# EAGLE design ais v1.1 (EAGLE 5.11)
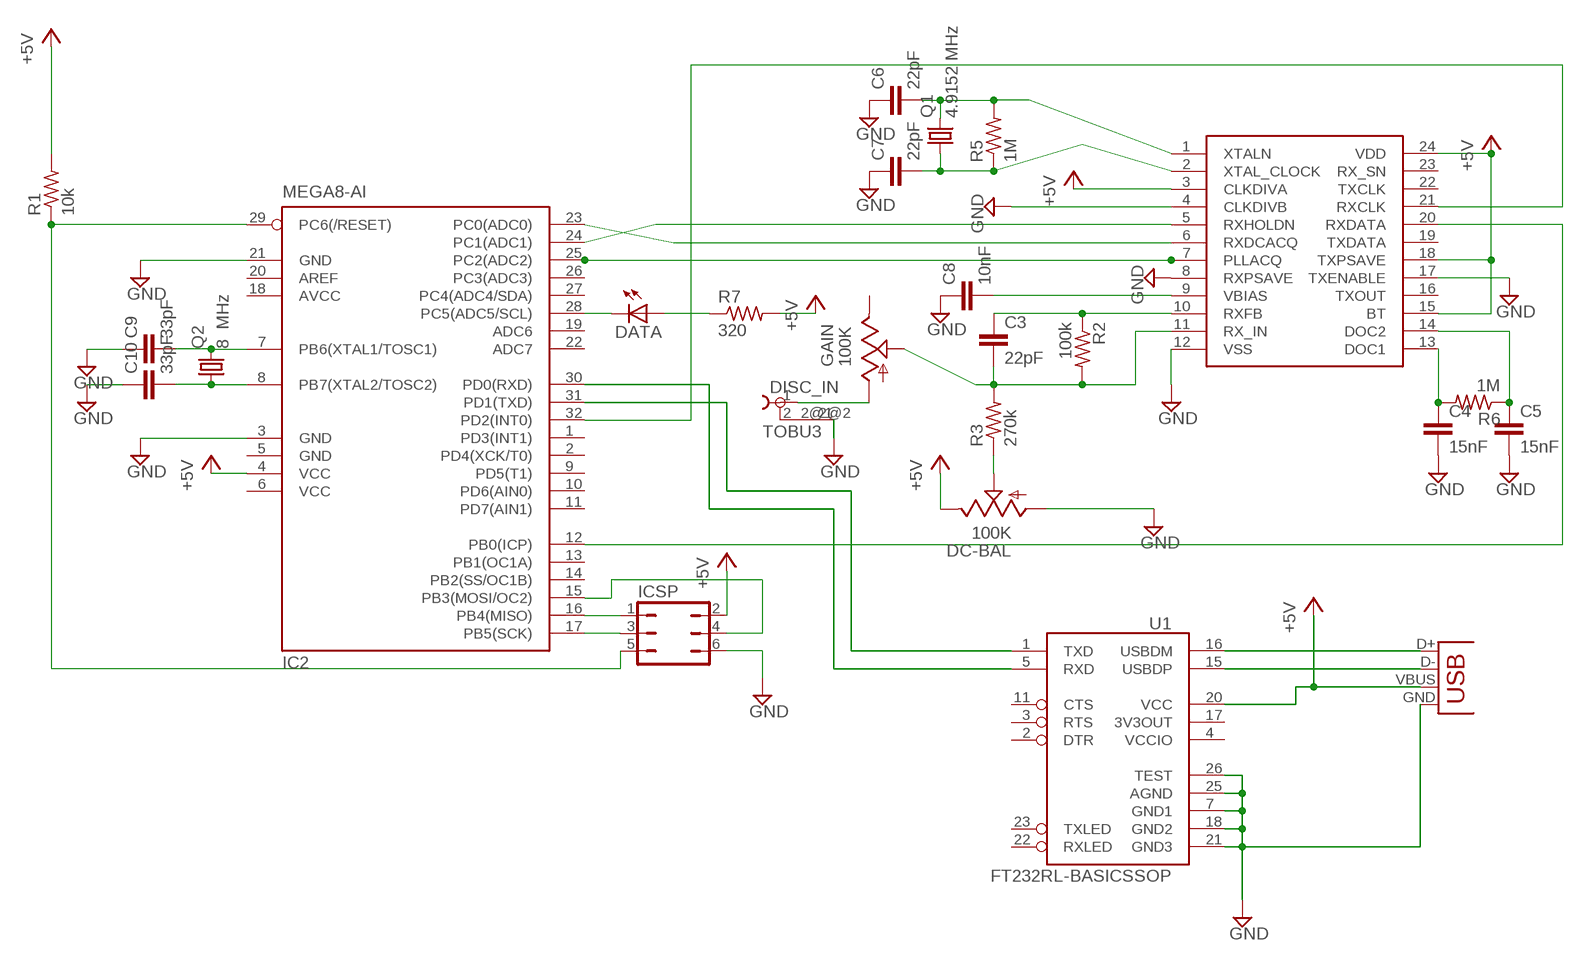
[diagram p0: schematic, sheet 1]

## Parts
C3  22pF  C-EUC0805K  [C0805K]
C4  15nF  C-EUC0805K  [C0805K]
C5  15nF  C-EUC0805K  [C0805K]
C6  22pF  C-EUC0805K  [C0805K]
C7  22pF  C-EUC0805K  [C0805K]
C8  10nF  C-EUC0805K  [C0805K]
C9  33pF  C-EUC0805K  [C0805K]
C10  33pF  C-EUC0805K  [C0805K]
CMX589  CMX589AD2  [DIL24-6]
DATA  LED5MM  [LED5MM]
DC-BAL  100K  TRIM_US-CA6V  [CA6V]
DISC_IN  TOBU3  [TOBU3]
GAIN  100K  TRIM_US-CA6V  [CA6V]
IC2  MEGA8-AI  [TQFP32-08]
ICSP  JP3Q  [JP3Q]
Q1  4.9152 MHz  CRYSTALHC49S  [HC49/S]
Q2  8 MHz  CRYSTALHC49S  [HC49/S]
R1  10k  R-US_0204/7  [0204/7]
R2  100k  R-US_M0805  [M0805]
R3  270k  R-US_M0805  [M0805]
R5  1M  R-US_M0805  [M0805]
R6  1M  R-US_M0805  [M0805]
R7  320  R-US_0309/12  [0309/12]
U1  FT232RL-BASICSSOP  [SSOP28DB]
X1  USBPTH  [USB-B-PTH]

## Nets
+5V: CMX589.3(CLKDIVA) CMX589.15(BT) CMX589.18(TXPSAVE) CMX589.24(VDD) DC-BAL.E IC2.4(VCC) ICSP.2 R1.2 R7.2 U1.20(VCC) X1.VBUS
GND: C4.2 C5.2 C6.1 C7.1 C8.1 C9.1 C10.1 CMX589.4(CLKDIVB) CMX589.8(RXPSAVE) CMX589.12(VSS) CMX589.17(TXENABLE) DISC_IN.2@2 IC2.3(GND) IC2.21(GND) U1.7(GND1) U1.18(GND2) U1.21(GND3) U1.25(AGND) U1.26(TEST) X1.GND
N$1: U1.15(USBDP) X1.D-
N$2: U1.16(USBDM) X1.D+
N$3: IC2.16(PB4(MISO)) ICSP.1
N$4: IC2.17(PB5(SCK)) ICSP.3
N$5: IC2.29(PC6(/RESET)) ICSP.5 R1.1
N$7: C9.2 IC2.7(PB6(XTAL1/TOSC1)) Q2.2
N$8: C10.2 IC2.8(PB7(XTAL2/TOSC2)) Q2.1
N$9: IC2.31(PD1(TXD)) U1.1(TXD)
N$10: C7.2 CMX589.2(XTAL_CLOCK) Q1.1 R5.1
N$11: CMX589.21(RXCLK) IC2.32(PD2(INT0))
N$12: CMX589.5(RXHOLDN) IC2.24(PC1(ADC1))
N$13: CMX589.6(RXDCACQ) IC2.23(PC0(ADC0))
N$14: CMX589.7(PLLACQ) IC2.25(PC2(ADC2))
N$15: CMX589.20(RXDATA) IC2.12(PB0(ICP))
N$16: DISC_IN.1 GAIN.A
N$17: C3.1 CMX589.10(RXFB) R2.1
N$18: DC-BAL.S R3.1
N$19: IC2.30(PD0(RXD)) U1.5(RXD)
N$24: C3.2 CMX589.11(RX_IN) GAIN.S R2.2 R3.2
N$25: C5.1 CMX589.14(DOC2) R6.1
N$26: C4.1 CMX589.13(DOC1) R6.2
N$27: C8.2 CMX589.9(VBIAS)
N$28: DATA.K(C) IC2.28(PC5(ADC5/SCL))
N$29: DATA.A R7.1
N$30: C6.2 CMX589.1(XTALN) Q1.2 R5.2
N$31: IC2.15(PB3(MOSI/OC2)) ICSP.4
N$33: ICSP.6
Unconnected: CMX589.16(TXOUT) CMX589.19(TXDATA) CMX589.22(TXCLK) CMX589.23(RX_SN) DC-BAL.A DISC_IN.2 DISC_IN.2@1 GAIN.E IC2.1(PD3(INT1)) IC2.2(PD4(XCK/T0)) IC2.9(PD5(T1)) IC2.10(PD6(AIN0)) IC2.11(PD7(AIN1)) IC2.13(PB1(OC1A)) IC2.14(PB2(SS/OC1B)) IC2.19(ADC6) IC2.20(AREF) IC2.22(ADC7) IC2.26(PC3(ADC3)) IC2.27(PC4(ADC4/SDA)) U1.2(DTR) U1.3(RTS) U1.11(CTS) U1.17(3V3OUT) U1.22(RXLED) U1.23(TXLED)

## Power pins joined to a net without a drawn wire
AVCC: IC2.18(AVCC)
GND: IC2.5(GND)
VCC: IC2.6(VCC)
VCCIO: U1.4(VCCIO)

## Library data of the parts
C3-C10 = rcl:C-EU: CAPACITOR, European symbol
CMX589 = cmx589:CMX589AD2: GMSK Modem
DATA = led:LED: LED OSRAM: - CHIPLED LG R971, LG N971, LY N971, LG Q971, LY Q971, LO R971, LY R971 LH N974, LH R974 LS Q976, LO Q976, LY Q976 LO Q996 - Hyper CHIPLED LW Q18S LB Q993, LB Q99A, LB R99A - SideLED LS A670, LO A670, LY A670, LG A670, LP A670 LB A673, LV A673, LT A673, LW A673 LH A674 LY A675 LS A676, LA A676, LO A676, LY A676, LW A676 LS A679, LY A679, LG A679 - Hyper Micro SIDELED® LS Y876, LA Y876, LO Y876, LY Y876 LT Y87S - SmartLED LW L88C, LW L88S LB L89C, LB L89S, LG L890 LS L89K, LO L89K, LY L89K LS L896, LA L896, LO L896, LY L896 - TOPLED LS T670, LO T670, LY T670, LG T670, LP T670 LSG T670, LSP T670, LSY T670, LOP T670, LYG T670 LG T671, LOG T671, LSG T671 LB T673, LV T673, LT T673, LW T673 LH T674 LS T676, LA T676, LO T676, LY T676, LB T676, LH T676, LSB T676, LW T676 LB T67C, LV T67C, LT T67C, LS T67K, LO T67K, LY T67K, LW E67C LS E67B, LA E67B, LO E67B, LY E67B, LB E67C, LV E67C, LT E67C LW T67C LS T679, LY T679, LG T679 LS T770, LO T770, LY T770, LG T770, LP T770 LB T773, LV T773, LT T773, LW T773 LH T774 LS E675, LA E675, LY E675, LS T675 LS T776, LA T776, LO T776, LY T776, LB T776 LHGB T686 LT T68C, LB T68C - Hyper Mini TOPLED® LB M676 - Mini TOPLED Santana® LG M470 LS M47K, LO M47K, LY M47K Source: http://www.osram.convergy.de LUXEON: - LUMILED® LXK2-PW12-R00, LXK2-PW12-S00, LXK2-PW14-U00, LXK2-PW14-V00 LXK2-PM12-R00, LXK2-PM12-S00, LXK2-PM14-U00 LXK2-PE12-Q00, LXK2-PE12-R00, LXK2-PE12-S00, LXK2-PE14-T00, LXK2-PE14-U00 LXK2-PB12-K00, LXK2-PB12-L00, LXK2-PB12-M00, LXK2-PB14-N00, LXK2-PB14-P00, LXK2-PB14-Q00 LXK2-PR12-L00, LXK2-PR12-M00, LXK2-PR14-Q00, LXK2-PR14-R00 LXK2-PD12-Q00, LXK2-PD12-R00, LXK2-PD12-S00 LXK2-PH12-R00, LXK2-PH12-S00 LXK2-PL12-P00, LXK2-PL12-Q00, LXK2-PL12-R00 Source: www.luxeon.com KINGBRIGHT: KA-3528ASYC Source: www.kingbright.com
DC-BAL GAIN = pot:TRIM_US-: POTENTIOMETER
DISC_IN = con-hirschmann:TOBU3: Female Cinch CONNECTOR ( RCA Jack )
IC2 = atmel:MEGA8: MICROCONTROLLER 8 Kbytes FLASH, 1 kbytes SRAM, 512 bytes EEPROM, USART, 6-channel 10 bit ADC, 2-channel 8 bit ADC Pin compatible with Atmega48, ATMega88, ATMega168 Source: avr.lbr
ICSP = jumper:JP3Q: JUMPER
Q1 Q2 = crystal:CRYSTAL: CRYSTAL
R1-R3 R5-R7 = rcl:R-US_: RESISTOR, American symbol
U1 = SparkFun:FT232RL-BASIC: USB UART This is the simplified version of the FT232RL unit. Only what you need, nothing you don't. Spark Fun Electronics SKU : COM-00650
X1 = SparkFun:USB: USB Connectors USB-B-PTH is fully proven SKU : PRT-00139 USB-miniB is fully proven SKU : PRT-00587 USB-A-PCB is untested. USB-A-H is throughly reviewed, but untested. Spark Fun Electronics SKU : PRT-00437 USB-B-SMT is throughly reviewed, but untested. Needs silkscreen touching up. USB-A-S has not been used/tested USB-MB-H has not been used/tested

## Board
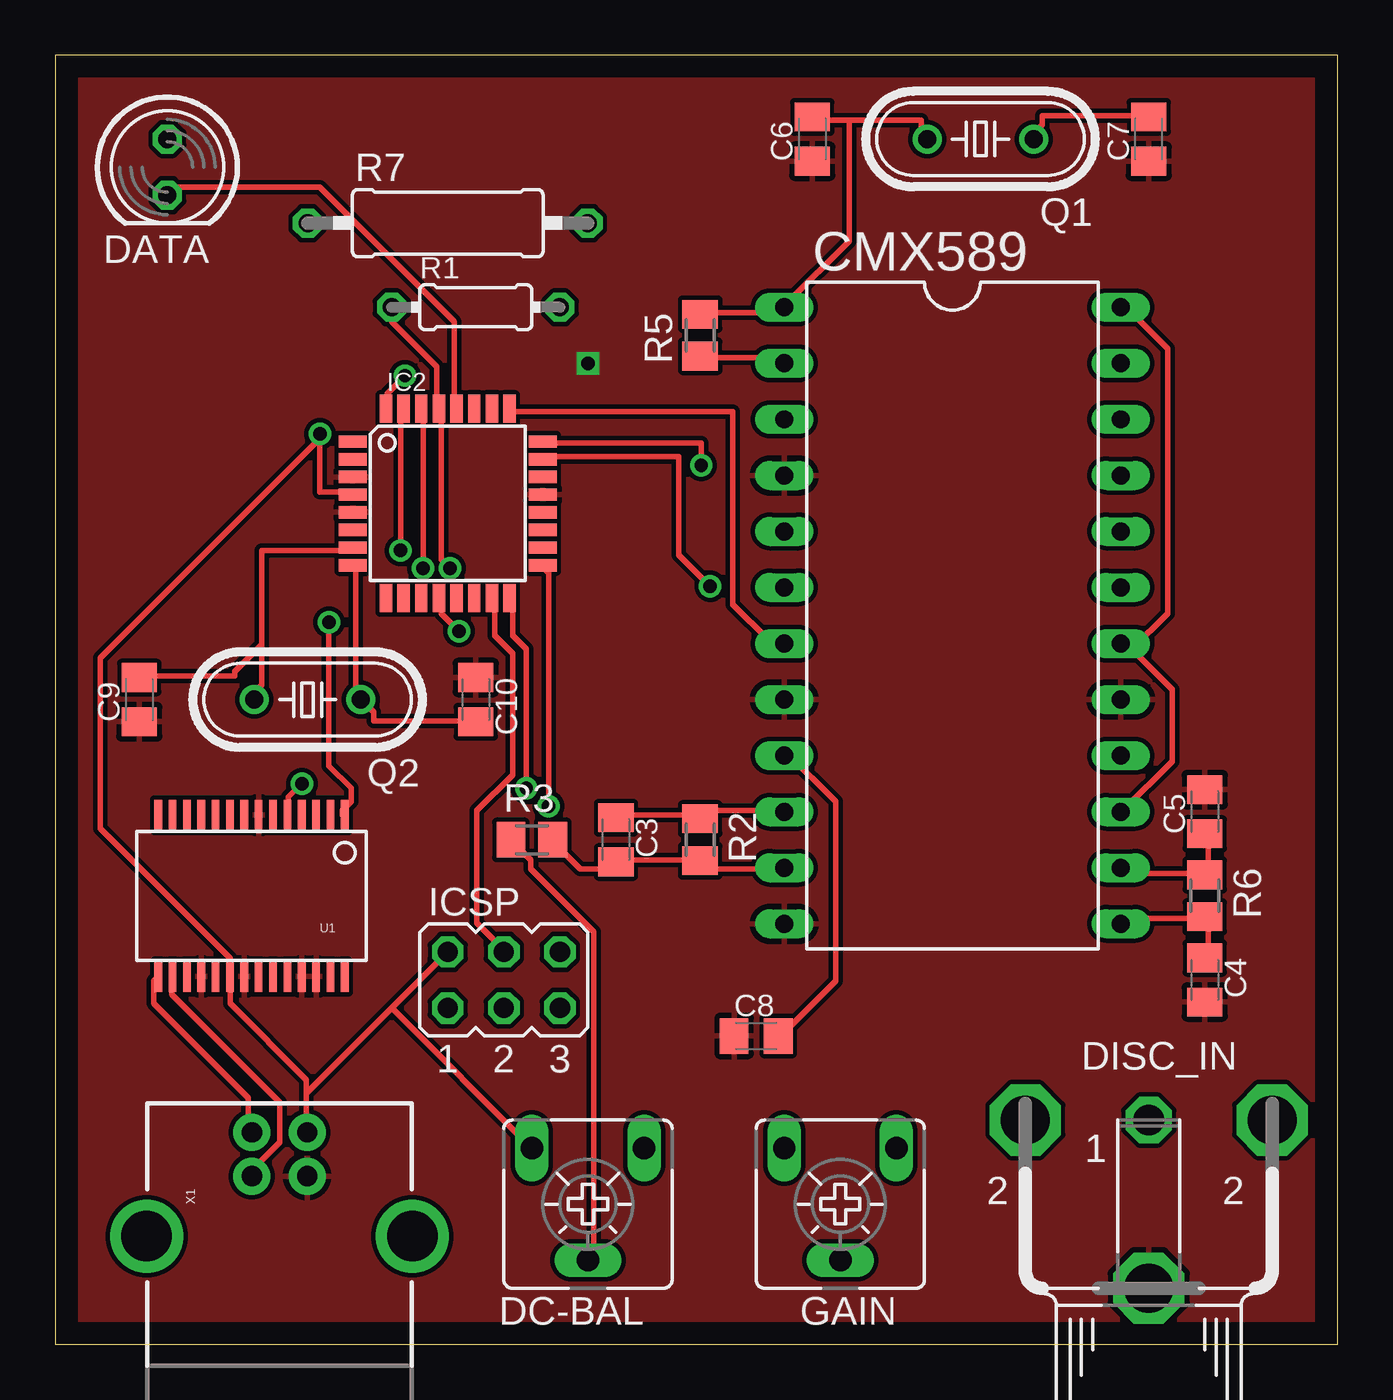
[diagram p1: board, top side]
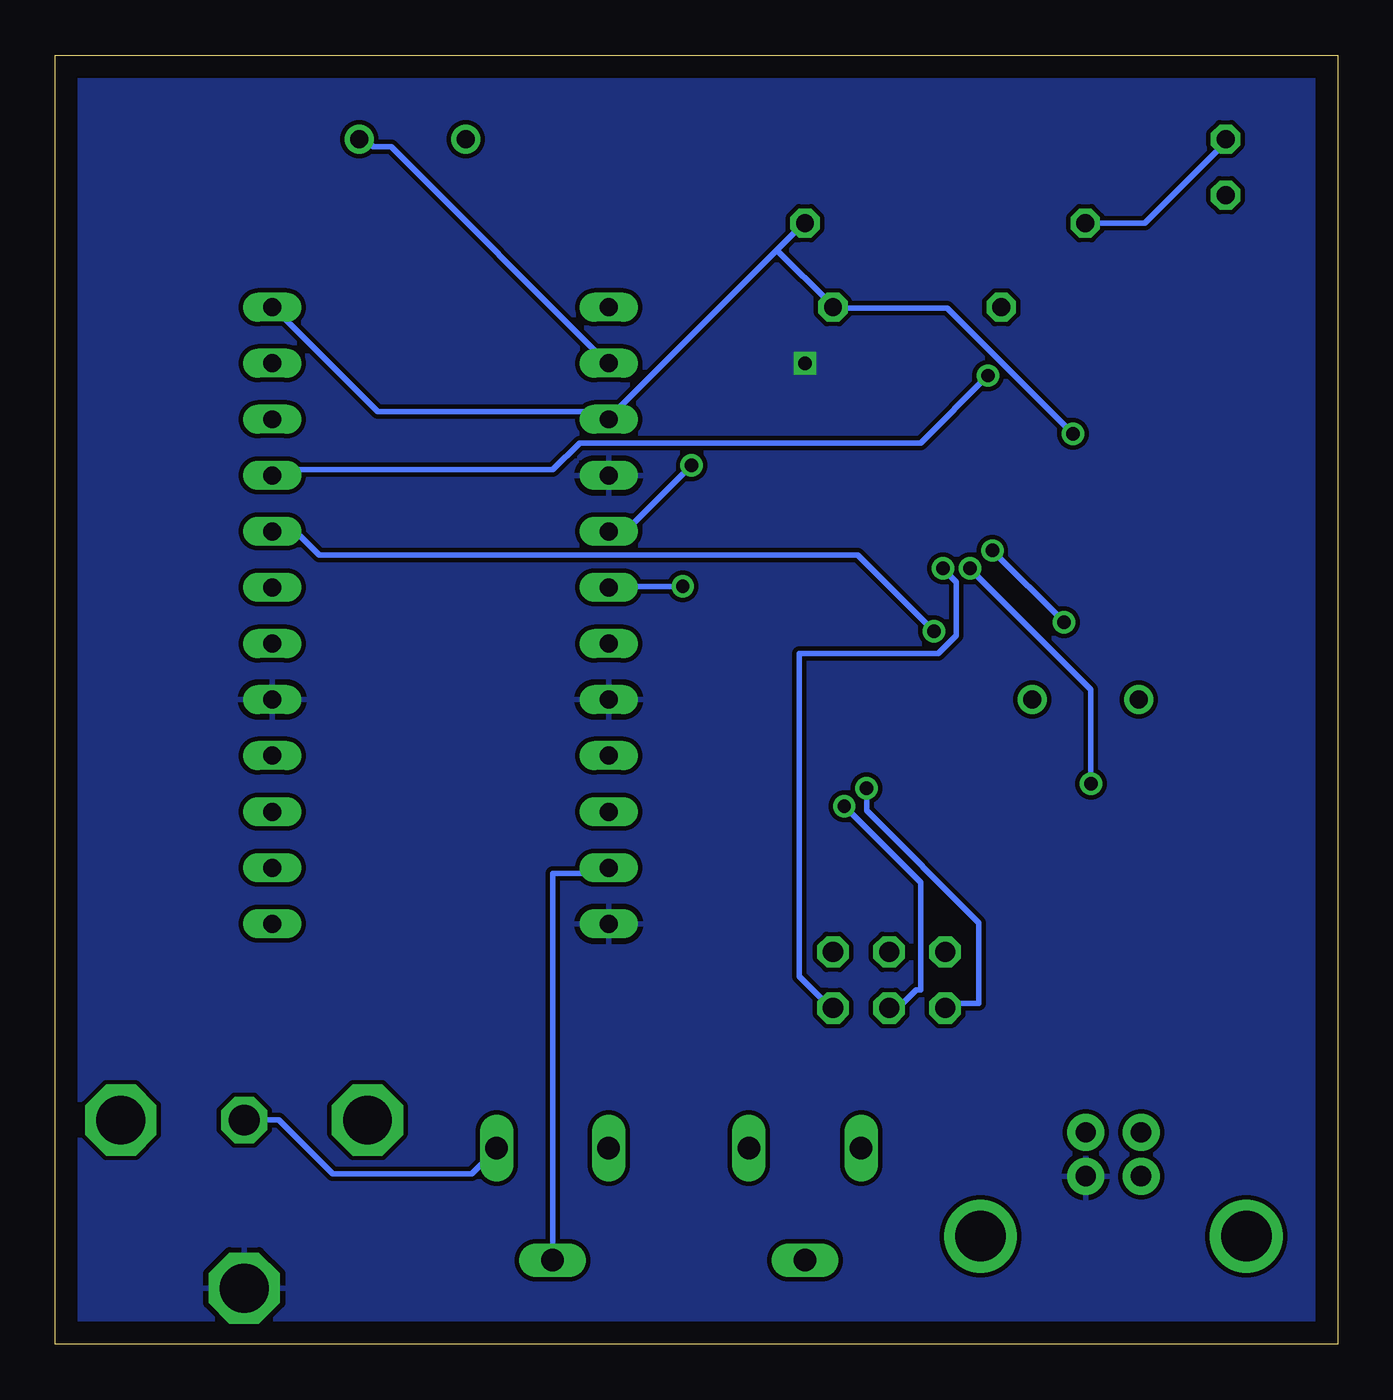
[diagram p2: board, bottom side, seen from below]

Size 58.09 x 58.41 mm. Coordinates in mm from the lower left corner, seen from the top.
Outline: 0,0 58.09,0 58.09,58.41 0,58.41 0,0
Copper layers (1*16): Top 0.035mm / dielectric 1.5mm / Bottom 0.035mm
Design rules "default": minimum track width 10mil, minimum drill 24mil, track to track 8mil, track to pad 8mil, pad to pad 8mil, via to via 8mil, smd to smd 8mil, copper to edge 40mil, drill to drill 8mil, minimum pad ring 10mil, minimum via ring 8mil, stop-mask expansion 4mil, vias tented up to drill 0mil, thermal gap 10mil

### Footprints (pad centres in the part's own frame; a part is rotated, then mirrored left to right if it is on the bottom)
C0805K = smd 1.3 x 1.6: 1 -1,0; 2 1,0
DIL24-6 = drill 0.813 long: 1 -19.05,-8.89; 2 -16.51,-8.89; 3 -13.97,-8.89; 4 -11.43,-8.89; 5 -8.89,-8.89; 6 -6.35,-8.89; 7 -3.81,-8.89; 8 -1.27,-8.89; 9 1.27,-8.89; 10 3.81,-8.89; 11 6.35,-8.89; 12 8.89,-8.89; 13 8.89,6.35; 14 6.35,6.35; 15 3.81,6.35; 16 1.27,6.35; 17 -1.27,6.35; 18 -3.81,6.35; 19 -6.35,6.35; 20 -8.89,6.35; 21 -11.43,6.35; 22 -13.97,6.35; 23 -16.51,6.35; 24 -19.05,6.35
LED5MM = drill 0.813 octagon: A -1.27,0; K 1.27,0
CA6V = drill 1.016 long: A -2.54,-2.54; E 2.54,-2.54; S 0,2.54
TOBU3 = drill 1.397 octagon: 1 0,-2.54 | drill 2.21 octagon: 2 5.588,-2.54; 2@1 -5.588,-2.54; 2@2 0,5.08
TQFP32-08 = smd 1.27 x 0.559: 1 -4.293,2.8; 2 -4.293,2; 3 -4.293,1.2; 4 -4.293,0.4; 5 -4.293,-0.4; 6 -4.293,-1.2; 7 -4.293,-2; 8 -4.293,-2.8; 17 4.293,-2.8; 18 4.293,-2; 19 4.293,-1.2; 20 4.293,-0.4; 21 4.293,0.4; 22 4.293,1.2; 23 4.293,2; 24 4.293,2.8 | smd 0.559 x 1.27: 9 -2.8,-4.293; 10 -2,-4.293; 11 -1.2,-4.293; 12 -0.4,-4.293; 13 0.4,-4.293; 14 1.2,-4.293; 15 2,-4.293; 16 2.8,-4.293; 25 2.8,4.293; 26 2,4.293; 27 1.2,4.293; 28 0.4,4.293; 29 -0.4,4.293; 30 -1.2,4.293; 31 -2,4.293; 32 -2.8,4.293
JP3Q = drill 0.914 octagon: 1 -2.54,-1.27; 2 -2.54,1.27; 3 0,-1.27; 4 0,1.27; 5 2.54,-1.27; 6 2.54,1.27
HC49/S = drill 0.813 round: 1 -2.413,0; 2 2.413,0
0204/7 = drill 0.813 octagon: 1 -3.81,0; 2 3.81,0
M0805 = smd 1.3 x 1.6: 1 -0.95,0; 2 0.95,0
0309/12 = drill 0.813 octagon: 1 -6.35,0; 2 6.35,0
SSOP28DB = smd 0.348 x 1.397: 1 -4.225,-3.656; 2 -3.575,-3.656; 3 -2.925,-3.656; 4 -2.275,-3.656; 5 -1.625,-3.656; 6 -0.975,-3.656; 7 -0.325,-3.656; 8 0.325,-3.656; 9 0.975,-3.656; 10 1.625,-3.656; 11 2.275,-3.656; 12 2.925,-3.656; 13 3.575,-3.656; 14 4.225,-3.656; 15 4.225,3.656; 16 3.575,3.656; 17 2.925,3.656; 18 2.275,3.656; 19 1.625,3.656; 20 0.975,3.656; 21 0.325,3.656; 22 -0.325,3.656; 23 -0.975,3.656; 24 -1.625,3.656; 25 -2.275,3.656; 26 -2.925,3.656; 27 -3.575,3.656; 28 -4.225,3.656
USB-B-PTH = drill 0.914 pad 1.676 round: D+ 0,1.25; D- 1.981,1.25; GND 0,-1.25; VBUS 1.981,-1.25 | drill 2.286 round: P$1 -2.718,-6.02; P$2 -2.718,6.02

### Placement (x,y rotation side)
C3  25.4,22.86 270 top
C4  52.07,16.51 270 top
C5  52.07,24.13 90 top
C6  34.29,54.61 90 top
C7  49.53,54.61 90 top
C8  31.75,13.97 0 top
C9  3.81,29.21 90 top
C10  19.05,29.21 270 top
CMX589  41.91,27.94 270 top
DATA  5.08,53.34 270 top
DC-BAL  24.13,6.35 180 top
DISC_IN  49.53,7.62 180 top
GAIN  35.56,6.35 180 top
IC2  17.78,38.1 0 top
ICSP  20.32,16.51 0 top
Q1  41.91,54.61 180 top
Q2  11.43,29.21 180 top
R1  19.05,46.99 0 top
R2  29.21,22.86 270 top
R3  21.59,22.86 0 top
R5  29.21,45.72 90 top
R6  52.07,20.32 270 top
R7  17.78,50.8 0 top
U1  8.89,20.32 180 top
X1  10.16,7.62 90 top

### Tracks (layer width: path | path; a pad name or v marks a point on that pad's centre or on a via)
+5V  (via drill 0.61)
  Top 0.254: 11.38,11.38 11.38,9.75 X1.VBUS | 11.38,11.38 11.38,11.99 7.92,15.44 U1.20 7.92,16.87 7.92,17.48 2.03,23.37 2.03,31.09 11.99,41.05 | 11.38,11.38 15.24,15.24 | 15.24,15.24 ICSP.2 | 15.24,15.24 DC-BAL.E | 11.99,41.05 11.99,38.61 13.41,38.61 IC2.4 | 48.77,31.5 48.36,31.9 CMX589.18 48.77,31.5 | 48.77,31.5 50.6,29.67 50.6,26.42 48.36,24.18 CMX589.15 | 48.77,31.5 50.39,33.12 50.39,45.11 48.36,47.14 CMX589.24 | 11.99,41.05 v11.99,41.25
  Bottom 0.254: v11.99,41.25 17.68,46.94 22.76,46.94 R1.2 22.96,47.14 25.4,49.58 | 25.4,49.58 24.18,50.8 R7.2 | 25.4,49.58 32.72,42.27 | 32.72,42.27 32.92,42.06 CMX589.3 32.72,42.27 | 32.72,42.27 43.48,42.27 48.16,46.94 CMX589.24
GND  (via drill 0.6)
  other vias: 24.13,44.45
  pour Bottom: 0,0 0,58.42 58.42,58.42 58.42,0
  pour Top: 0,0 0,58.42 58.42,58.42 58.42,0
N$1
  Top 0.254: U1.15 4.47,16.46 4.47,15.44 8.74,11.18 8.74,9.75 X1.D-
N$2
  Top 0.254: U1.16 5.28,16.66 5.28,15.85 10.16,10.97 10.16,9.14 8.94,7.92 8.94,7.72 X1.D+
N$3  (via drill 0.61)
  Top 0.254: v21.34,25.2 21.34,31.5 20.73,32.11 20.73,33.73 IC2.16
  Bottom 0.254: v21.34,25.2 21.34,24.18 16.26,19.1 16.26,15.44 17.48,15.44 17.68,15.24 ICSP.1
N$4  (via drill 0.61)
  Top 0.254: v22.35,24.38 22.35,34.95 22.15,35.15 IC2.17
  Bottom 0.254: v22.35,24.38 18.9,20.93 18.9,16.05 19.1,16.05 19.91,15.24 ICSP.3
N$5  (via drill 0.61)
  Top 0.254: R1.1 15.24,46.33 17.27,44.3 17.27,42.47 IC2.29 17.48,42.27 17.48,35.56 v17.88,35.15
  Bottom 0.254: v17.88,35.15 17.27,34.54 17.27,32.11 18.09,31.29 24.38,31.29 24.38,16.66 22.96,15.24 ICSP.5
N$7
  Top 0.254: 9.35,31.7 9.35,29.87 9.14,29.67 9.14,29.26 Q2.2 | 9.35,31.7 9.35,35.97 13.41,35.97 IC2.7 | 9.35,31.7 8.13,30.48 8.13,30.28 3.86,30.28 C9.2
N$8
  Top 0.254: IC2.8 13.61,35.15 13.61,29.46 13.82,29.26 Q2.1 14.02,29.06 14.43,28.65 14.43,28.25 18.9,28.25 C10.2
N$9  (via drill 0.61)
  Top 0.254: v15.65,35.97 15.65,42.27 IC2.31 | v12.39,32.72 12.39,26.21 13.41,25.2 13.41,24.59 13.01,24.18 13.01,23.98 U1.1
  Bottom 0.254: v12.39,32.72 v15.65,35.97
N$10
  Top 0.254: R5.1 29.26,44.7 32.92,44.7 32.92,44.5 CMX589.2 | C7.2 49.38,55.68 44.7,55.68 44.7,55.27 44.5,55.07 44.5,54.66 Q1.1
  Bottom 0.254: CMX589.2 33.12,44.5 42.88,54.25 43.69,54.25 43.89,54.46 44.3,54.46 Q1.1
N$11  (via drill 0.61)
  Top 0.254: v15.85,43.89 15.04,43.08 15.04,42.47 IC2.32
  Bottom 0.254: v15.85,43.89 18.9,40.84 34.34,40.84 35.56,39.62 47.95,39.62 48.16,39.42 CMX589.21
N$12  (via drill 0.61)
  Top 0.254: v29.26,39.83 29.26,40.84 22.15,40.84 IC2.24
  Bottom 0.254: v29.26,39.83 32.11,36.98 32.92,36.98 CMX589.5
N$13  (via drill 0.61)
  Top 0.254: v29.67,34.34 28.25,35.76 28.25,40.23 22.15,40.23 IC2.23
  Bottom 0.254: v29.67,34.34 32.92,34.34 CMX589.6
N$14
  Top 0.254: IC2.25 20.73,42.27 30.68,42.27 30.68,33.53 32.31,31.9 32.92,31.9 CMX589.7
N$15  (via drill 0.61)
  Top 0.254: v18.29,32.31 17.48,33.12 17.48,33.73 IC2.12
  Bottom 0.254: v18.29,32.31 21.74,35.76 46.13,35.76 47.14,36.78 48.16,36.78 CMX589.20
N$16
  Bottom 0.254: GAIN.A 38.2,8.74 39.22,7.72 45.52,7.72 47.95,10.16 DISC_IN.1
N$17
  Top 0.254: C3.1 25.4,23.98 29.06,23.98 R2.1 29.26,23.98 29.26,24.18 32.92,24.18 CMX589.10
N$18
  Top 0.254: R3.1 20.73,22.76 21.54,21.95 21.54,21.54 24.38,18.69 24.38,4.06 DC-BAL.S
N$19  (via drill 0.61)
  Top 0.254: v16.66,35.15 16.66,42.27 IC2.30 | v11.18,25.4 10.57,24.79 10.57,23.98 U1.5
  Bottom 0.254: v16.66,35.15 11.18,29.67 v11.18,25.4
N$24
  Top 0.254: R3.2 22.55,22.76 23.77,21.54 25.4,21.54 C3.2 25.4,21.95 29.06,21.95 R2.2 29.26,21.74 29.26,21.54 32.92,21.54 CMX589.11
  Bottom 0.254: GAIN.S 35.56,21.34 33.33,21.34 33.12,21.54 CMX589.11
N$25
  Top 0.254: C5.1 52.22,22.96 52.22,21.34 R6.1 52.02,21.34 48.36,21.34 48.36,21.54 CMX589.14
N$26
  Top 0.254: C4.1 52.22,17.68 52.22,19.3 R6.2 52.02,19.3 48.36,19.3 48.36,19.1 CMX589.13
N$27
  Top 0.254: C8.2 32.92,14.02 35.36,16.46 35.36,24.59 33.12,26.82 CMX589.9
N$28
  Top 0.254: IC2.28 18.09,42.47 18.09,46.33 11.99,52.43 5.08,52.43 DATA.K
N$29
  Bottom 0.254: DATA.A 5.08,54.46 8.74,50.8 R7.1
N$30
  Top 0.254: R5.2 29.26,46.74 32.92,46.74 32.92,46.94 CMX589.1 33.12,47.14 35.97,49.99 35.97,55.47 | 35.97,55.47 39.22,55.47 39.22,54.86 39.42,54.66 Q1.2 | 35.97,55.47 34.34,55.47 C6.2
N$31
  Top 0.254: IC2.15 19.91,33.73 19.91,32.11 20.73,31.29 20.73,25.81 19.1,24.18 19.1,19.1 20.32,17.88 ICSP.4